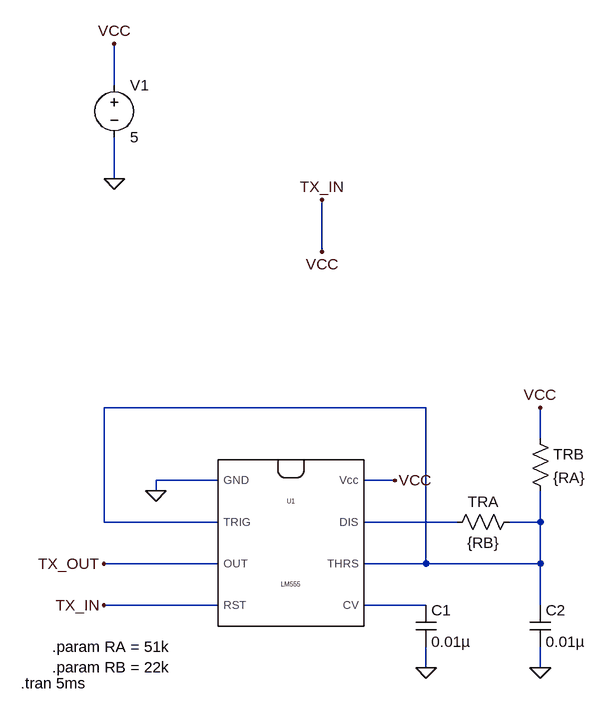
[diagram p0: schematic Transmitter.asc]
Transmitter.asc, the LTspice schematic file:
Version 4
SHEET 1 880 680
WIRE -32 -544 -32 -608
WIRE -32 -400 -32 -464
WIRE 288 -288 288 -368
WIRE 448 -48 -48 -48
WIRE 624 0 624 -48
WIRE 128 64 32 64
WIRE 400 64 352 64
WIRE 32 80 32 64
WIRE -48 128 -48 -48
WIRE 128 128 -48 128
WIRE 496 128 352 128
WIRE 624 128 624 80
WIRE 624 128 576 128
WIRE 128 192 -48 192
WIRE 448 192 448 -48
WIRE 448 192 352 192
WIRE 624 192 624 128
WIRE 624 192 448 192
WIRE 128 256 -48 256
WIRE 448 256 352 256
WIRE 624 256 624 192
WIRE 448 352 448 320
WIRE 624 352 624 320
FLAG 400 64 VCC
FLAG 32 80 0
FLAG -32 -400 0
FLAG -32 -608 VCC
FLAG 448 352 0
FLAG 624 352 0
FLAG 624 -48 VCC
FLAG -48 192 TX_OUT
FLAG -48 256 TX_IN
FLAG 288 -368 TX_IN
FLAG 288 -288 VCC
SYMBOL LM555 240 160 R0
SYMATTR InstName U1
SYMBOL res 592 112 R90
WINDOW 0 0 56 VBottom 2
WINDOW 3 32 56 VTop 2
SYMATTR InstName TRA
SYMATTR Value {RB}
SYMBOL voltage -32 -560 R0
WINDOW 123 0 0 Left 2
WINDOW 39 0 0 Left 2
SYMATTR InstName V1
SYMATTR Value 5
SYMBOL cap 432 256 R0
SYMATTR InstName C1
SYMATTR Value 0.01µ
SYMBOL cap 608 256 R0
SYMATTR InstName C2
SYMATTR Value 0.01µ
SYMBOL res 608 -16 R0
SYMATTR InstName TRB
SYMATTR Value {RA}
TEXT -128 320 Left 2 !.param RA = 51k\n.param RB = 22k
TEXT -176 376 Left 2 !.tran 5ms

The netlist it stands for:
* Transmitter.asc
XU1 0 N001 TX_OUT TX_IN N003 N001 N002 TX_IN NE555  ; pins GND TRIG OUT RST CV THRS DIS Vcc
R§TRA N001 N002 {RB}
V1 TX_IN 0 5
C1 N003 0 0.01µ
C2 N001 0 0.01µ
R§TRB TX_IN N001 {RA}
.param RA = 51k
.param RB = 22k
.tran 5ms
.lib NE555.sub
.backanno
.end